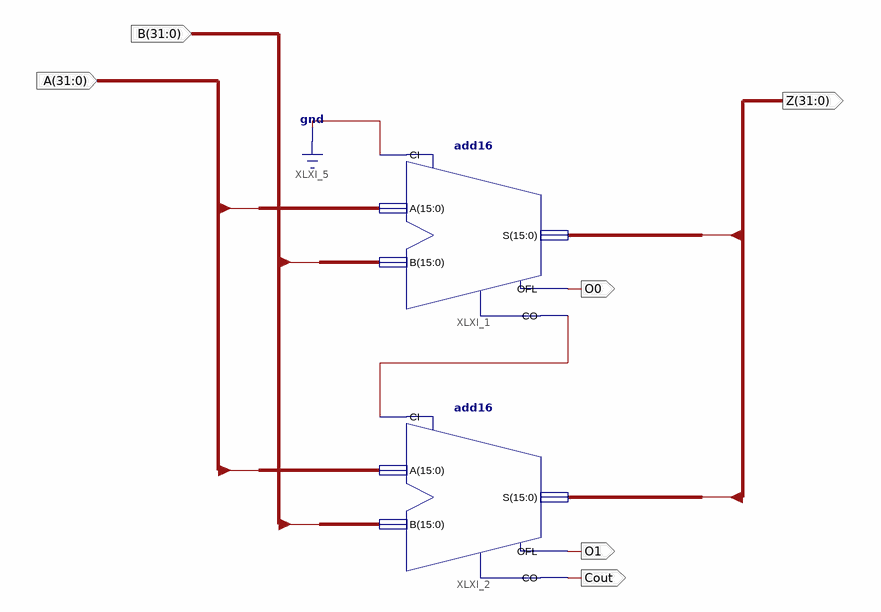
[diagram p0: schematic sheet 1]
// Xilinx ISE schematic adder.sch (xa9500xl) as structural Verilog: 2 symbols, 6 ports
module adder (
  input  [31:0] A,
  input  [31:0] B,
  output [31:0] Z,
  output O1,
  output O0,
  output Cout
);

  wire XLXN_4;

  add16 XLXI_1 (.A(A[15:0]), .B(B[15:0]), .CI(1'b0), .CO(XLXN_4), .OFL(O0), .S(Z[15:0]));
  add16 XLXI_2 (.A(A[31:16]), .B(B[31:16]), .CI(XLXN_4), .CO(Cout), .OFL(O1), .S(Z[31:16]));
endmodule
